# Altium schematic sheet G-103P-20190808.SchDoc
size A4
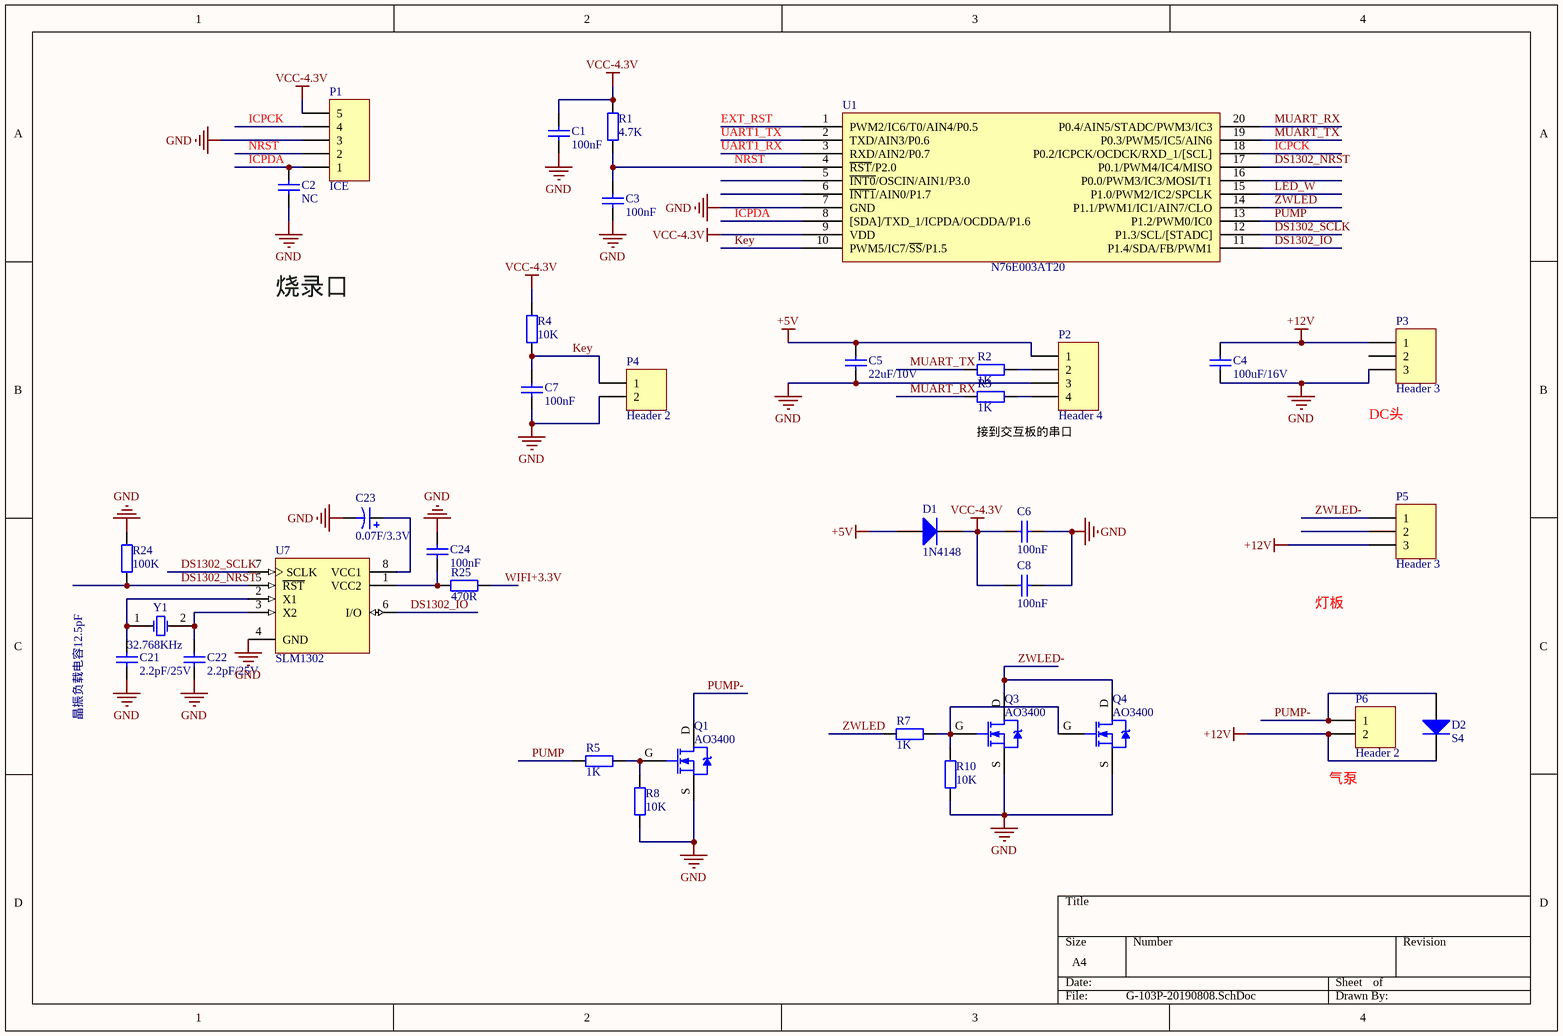
[diagram p0: G-103P-20190808.SchDoc]

## Parts
C1  value 100nF  [SMD-0603]  (hidden comment: Cap)
C2  NC  [SMD-0603]
C3  value 100nF  [SMD-0603]  (hidden comment: Cap)
C4  100uF/16V  [CAPR6.3W]
C5  22uF/10V  [SMD-0603]
C6  100nF  [SMD-0603]
C7  100nF  [SMD-0603]
C8  100nF  [SMD-0603]
C21  2.2pF/25V  [SMD-0603M]
C22  2.2pF/25V  [SMD-0603M]
C23  0.07F/3.3V  [CS-ME-414-TA]
C24  100nF  [SMD-0603M]
D1  1N4148  [SOD123]
D2  S4  [SOD123]
P1  ICE  [HDR1X5]
P2  Header 4  [PH-2.0-4P]
P3  Header 3  [DC-MU]
P4  Header 2  [KYE-F]
P5  Header 3  [2.54-3PW]
P6  Header 2  [2.54-2PW]
Q1  AO3400  [SOT-23E3]
Q3  AO3400  [SOT-23E3]
Q4  AO3400  [SOT-23E3]
R1  value 4.7K  [SMD-0603]  (hidden comment: Res2)
R2  1K  [SMD-0603]
R3  1K  [SMD-0603]
R4  10K  [SMD-0603]
R5  1K  [SMD-0603]
R7  1K  [SMD-0603]
R8  10K  [SMD-0603]
R10  10K  [SMD-0603]
R24  100K  [SMD-0603M]
R25  470R  [SMD-0603M]
U1  N76E003AT20  [TSSOP-20]
U7  SLM1302  [SOP8]
Y1  32.768KHz  [BCY-W2/D3.1]

## Nets
+5V: C5.2 D1.1(A) P2.1
+12V: C4.2 D2.2(K) P3.1 P5.3 P6.2
GND: C1.1 C2.2 C3.1 C4.1 C5.1 C6.1 C7.2 C8.1 C21.1 C22.1 C23.2 C24.2 P1.3 P2.3 P3.3 P4.2 Q1.S Q3.S Q4.S R8.2 R10.2 R24.1 U1.7(GND) U7.4(GND)
VCC-4.3V: C1.2 C6.2 C8.2 D1.2(K) P1.5 R1.1 R4.1 U1.9(VDD)
DS1302_IO: U1.11(P1.4/SDA/FB/PWM1) U7.6(I/O)
DS1302_NRST: R24.2 U1.17(P0.1/PWM4/IC4/MISO) U7.5(~{RST})
DS1302_SCLK: U1.12(P1.3/SCL/[STADC]) U7.7(SCLK)
EXT_RST: U1.1(PWM2/IC6/T0/AIN4/P0.5)
ICPCK: P1.4 U1.18(P0.2/ICPCK/OCDCK/RXD_1/[SCL])
ICPDA: C2.1 P1.1 U1.8([SDA]/TXD_1/ICPDA/OCDDA/P1.6)
Key: C7.1 P4.1 R4.2 U1.10(PWM5/IC7/~{SS}/P1.5)
LED_W: U1.15(P1.0/PWM2/IC2/SPCLK)
MUART_RX: R3.2 U1.20(P0.4/AIN5/STADC/PWM3/IC3)
MUART_TX: R2.2 U1.19(P0.3/PWM5/IC5/AIN6)
NRST: C3.2 P1.2 R1.2 U1.4(~{RST}/P2.0)
PUMP: R5.2 U1.13(P1.2/PWM0/IC0)
PUMP-: D2.1(A) P6.1 Q1.D
UART1_RX: U1.3(RXD/AIN2/P0.7)
UART1_TX: U1.2(TXD/AIN3/P0.6)
WIFI+3.3V: R25.1
ZWLED: R7.2 U1.14(P1.1/PWM1/IC1/AIN7/CLO)
ZWLED-: P5.1 Q3.D Q4.D
NetC21_2: C21.2 U7.2(X1) Y1.1(OSC1)
NetC22_2: C22.2 U7.3(X2) Y1.2(OSC2)
NetC23_1: C23.1 U7.8(VCC1)
NetC24_1: C24.1 R25.2 U7.1(VCC2)
NetP2_2: P2.2 R2.1
NetP2_4: P2.4 R3.1
NetQ1_G: Q1.G R5.1 R8.1
NetQ3_G: Q3.G Q4.G R7.1 R10.1

Not connected (* = marked no-connect by the designer): P3 2; P5 2; U1 5(~{INT0}/OSCIN/AIN1/P3.0) 6(~{INT1}/AIN0/P1.7) 16(P0.0/PWM3/IC3/MOSI/T1)

## Notes on the sheet
- 烧录口
- 接到交互板的串口
- (near P3) DC头
- 灯板
- (near C21) 晶振负载电容12.5pF
- (near P6) 气泵

## Library data of the parts
C1-C8 C21 C22 C24 = Cap: Capacitor; Published: 8-Jun-2000; LatestRevisionDate: 17-Jul-2002; LatestRevisionNote: Re-released for DXP Platform.; PackageReference: RAD-0.3; Publisher: Altium Limited
  C2: Value: NC
  C4: Value: 100uF/16V
  C5: Value: 22uF/10V
  C6-C8 C24: Value: 100nF
  C21 C22: Value: 2.2pF/25V
C23 = Cap Pol1: Polarized Capacitor (Radial); Published: 8-Jun-2000; LatestRevisionDate: 17-Jul-2002; LatestRevisionNote: Re-released for DXP Platform.; PackageReference: RB7.6-15; Publisher: Altium Limited; Value: 0.07F/3.3V
D1 D2 = Diode 1N4007: 1 Amp General Purpose Rectifier; Published: 8-Jun-2000; LatestRevisionDate: 17-Jul-2002; LatestRevisionNote: Re-released for DXP Platform.; DatasheetVersion: 1998; PackageVersion: Aug-1999; PackageReference: DO-41; Publisher: Altium Limited; Code_JEDEC: DO-204-AL; ComponentLink1Description: Manufacturer Link; ComponentLink1URL: http://www.fairchildsemi.com/; ComponentLink2Description: Datasheet; ComponentLink2URL: http://www.fairchildsemi.com/ds/1N%2F1N4001.pdf
P1 = Header 5: Header, 5-Pin; LatestRevisionDate: 17-Jul-2002; LatestRevisionNote: Re-released for DXP Platform.; Publisher: Altium Limited
P2 = Header 4: Header, 4-Pin; LatestRevisionDate: 17-Jul-2002; LatestRevisionNote: Re-released for DXP Platform.; Publisher: Altium Limited
P3 P5 = Header 3: Header, 3-Pin; LatestRevisionDate: 17-Jul-2002; LatestRevisionNote: Re-released for DXP Platform.; Publisher: Altium Limited
P4 P6 = Header 2: Header, 2-Pin; LatestRevisionDate: 17-Jul-2002; LatestRevisionNote: Re-released for DXP Platform.; Publisher: Altium Limited
Q1 Q3 Q4 = NMOS-2: N-Channel Power MOSFET; Note: Pin 2 is electrically connected to pin 4.; Published: 8-Jun-2000; LatestRevisionDate: 17-Jul-2002; LatestRevisionNote: Re-released for DXP Platform.; DatasheetVersion: PD-9.814; PackageReference: TO-220AB; Publisher: Altium Limited; Code_JEDEC: TO-220-AB; ComponentLink1Description: Manufacturer Link; ComponentLink1URL: http://www.irf.com/
R1-R3 R5 R7 R24 R25 = Res2: Resistor; Published: 8-Jun-2000; LatestRevisionDate: 17-Jul-2002; LatestRevisionNote: Re-released for DXP Platform.; PackageReference: AXIAL-0.4; Publisher: Altium Limited
  R2 R3 R5 R7: Value: 1K
  R24: Value: 100K
  R25: Value: 470R
R4 R8 R10 = Res2: Resistor; Value: 1K; Published: 8-Jun-2000; LatestRevisionDate: 17-Jul-2002; LatestRevisionNote: Re-released for DXP Platform.; PackageReference: AXIAL-0.4; Publisher: Altium Limited
U7 = DS1302Z: Trickle Charge Timekeeping Chip; Published: 13-Oct-2000; LatestRevisionDate: 13-Apr-2006; LatestRevisionNote: IPC-7351 Footprint Added.; DatasheetVersion: 2-Jul-1999; PackageVersion: 1999; PackageReference: SOIC8N; Publisher: Altium Limited; PackageDescription: 8-Pin Small Outline Integrated Circuit 1.27 mm Pitch; Code_IPC: SOIC127P600-8; ComponentLink1Description: Manufacturer Link; ComponentLink1URL: http://www.maxim-ic.com/; ComponentLink2Description: Datasheet; ComponentLink2URL: http://pdfserv.maxim-ic.com/en/ds/DS1302.pdf; ComponentLink3Description: Discontinuation Notice; ComponentLink3URL: http://www.maxim-ic.com/qa/pdfs/non-obsolescence-letter.pdf
Y1 = XTAL: Crystal Oscillator; Published: 8-Jun-2000; LatestRevisionDate: 17-Jul-2002; LatestRevisionNote: Re-released for DXP Platform.; PackageReference: R38; Publisher: Altium Limited